# EasyEDA schematic SCH_Acid-Leak_2026-06-09.json
TITLE: ACID LEAK - Bass Distortion; REV: 1.0; Date: 2026-06-05; Sheet: 1/1; Drawn By: Jakub Krysakowski
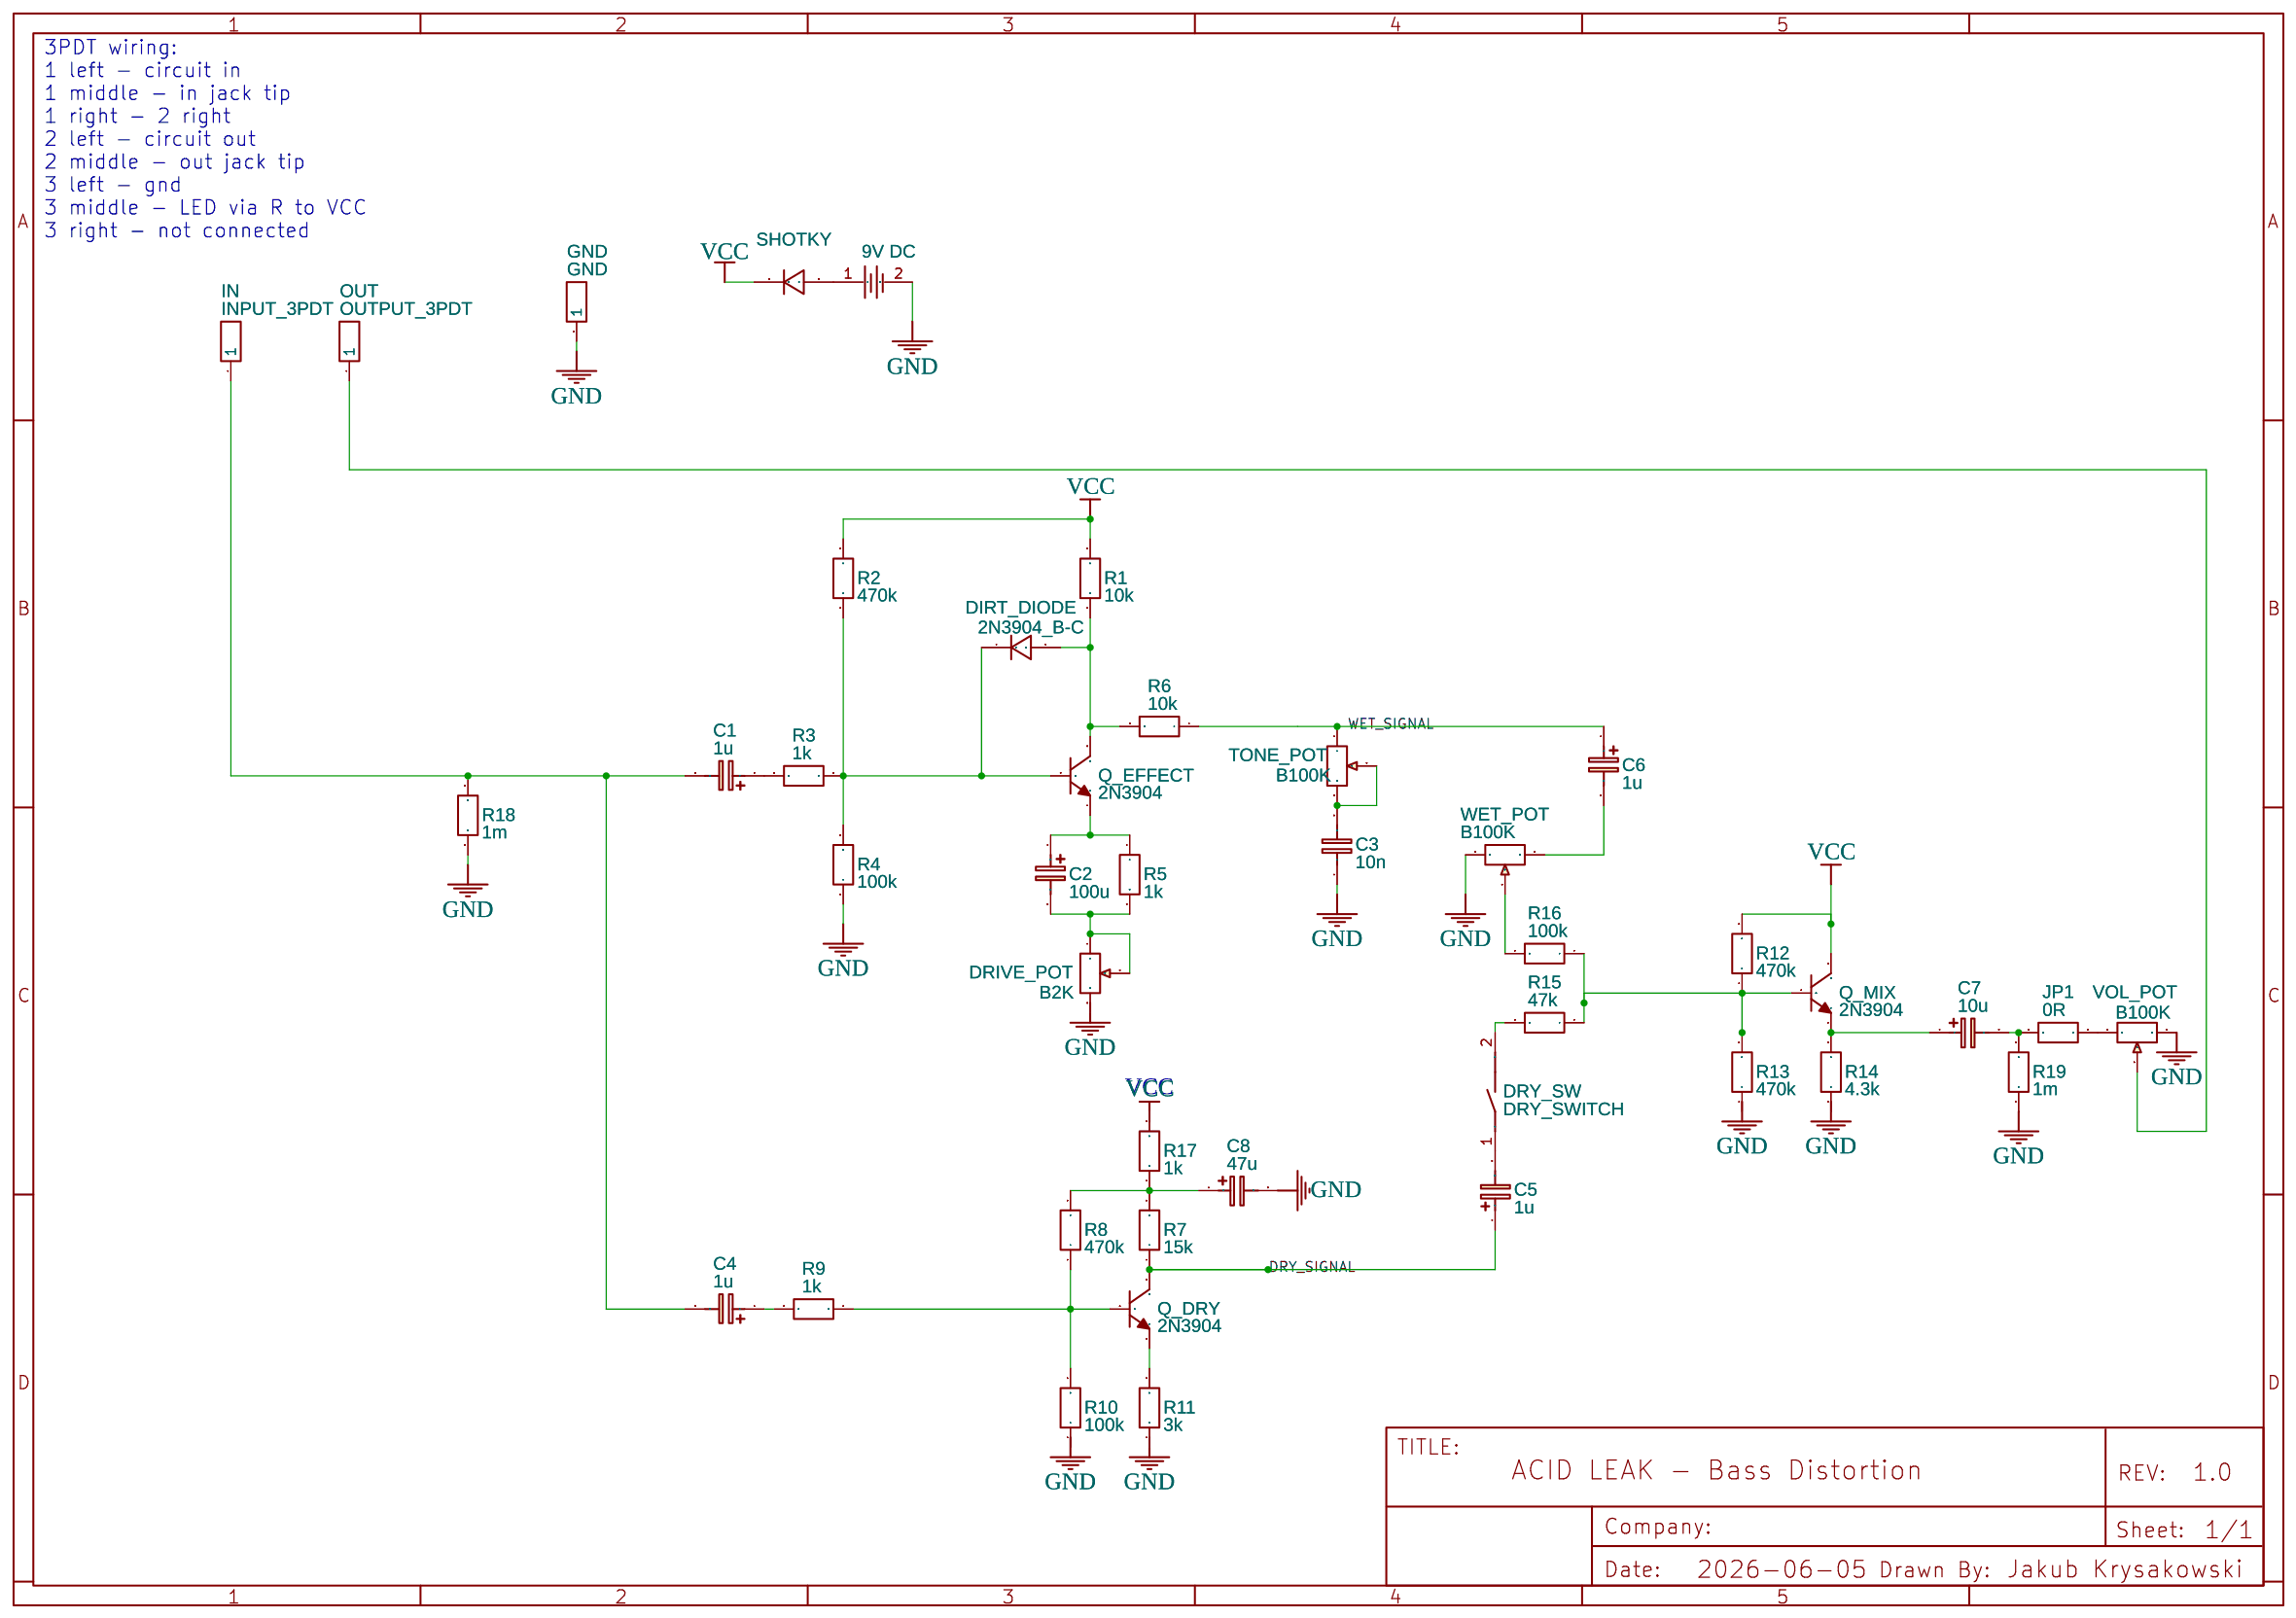
[diagram p0: schematic sheet]

## Parts
C1  1u  [CAP-5*12]
C2  100u  [CAP-5*12]
C3  10n  [CAP-5*9.5*3]
C4  1u  [CAP-5*12]
C5  1u  [CAP-5*12]
C6  1u  [CAP-5*12]
C7  10u  [CAP-5*12]
C8  47u  [CAP-5*12]
DIRT_DIODE  2N3904_B-C  [DIODE]
DRIVE_POT  B2K  [POTENTIOMETER]
DRY_SW  DRY_SWITCH  [SW]
GND  GND  [HDR-M-2.54_1X1]
IN  INPUT_3PDT  [HDR-M-2.54_1X1]
JP1  0R  [R_AXIAL-0.3]
OUT  OUTPUT_3PDT  [HDR-M-2.54_1X1]
PWR  9V DC  [9V]
Q_DRY  2N3904  [TO-92-3_L4.6-W3.6-P1.30-L_2N3904]
Q_EFFECT  2N3904  [TO-92-3_L4.6-W3.6-P1.30-L_2N3904]
Q_MIX  2N3904  [TO-92-3_L4.6-W3.6-P1.30-L_2N3904]
R1  10k  [R_AXIAL-0.3]
R2  470k  [R_AXIAL-0.3]
R3  1k  [R_AXIAL-0.3]
R4  100k  [R_AXIAL-0.3]
R5  1k  [R_AXIAL-0.3]
R6  10k  [R_AXIAL-0.3]
R7  15k  [R_AXIAL-0.3]
R8  470k  [R_AXIAL-0.3]
R9  1k  [R_AXIAL-0.3]
R10  100k  [R_AXIAL-0.3]
R11  3k  [R_AXIAL-0.3]
R12  470k  [R_AXIAL-0.3]
R13  470k  [R_AXIAL-0.3]
R14  4.3k  [R_AXIAL-0.3]
R15  47k  [R_AXIAL-0.3]
R16  100k  [R_AXIAL-0.3]
R17  1k  [R_AXIAL-0.3]
R18  1m  [R_AXIAL-0.3]
R19  1m  [R_AXIAL-0.3]
SHOTKY  Shotky  [DO-35_BD2.0-L4.2-P8.20-D0.5-RD]
TONE_POT  B100K  [POTENTIOMETER]
VOL_POT  B100K  [POTENTIOMETER]
WET_POT  B100K  [POTENTIOMETER]

## Library data of the parts
C1 C2 C4-C8 = CE_TH_D8.0×F3.5_EU: Contributor: LCEDA_Lib
C3 = C_RAD-0.1_EU: Contributor: LCEDA_Lib
DIRT_DIODE = 1N4148: Supplier: LCSC; Supplier Part: C13769; Manufacturer: STMicroelectronics; Contributor: LCSC; Package Display: No
DRIVE_POT TONE_POT VOL_POT WET_POT = R_3296W_EU: Supplier: LCSC; Contributor: LCEDA_Lib; Value(Ω): 10k
DRY_SW = DS-1-B-T: Supplier: LCSC; Supplier Part: C7503464; Manufacturer: XUNPU(讯普); Contributor: lcsc; JLCPCB Part Class: Extended Part
GND IN OUT = HDR-M-2.54_1x1: Supplier Part: C81276; Supplier: LCSC; Contributor: LCEDA_Lib
JP1 R1-R6 R8-R19 = R_0603_EU: Contributor: LCEDA_Lib
PWR = CR2032-BS-2-1: Supplier: LCSC; Manufacturer: Q&J; Manufacturer Part: BS-2-1; image: //image.lceda.cn/szlcsc/C70376.jpg; Supplier Part: C70376; Package Display: No
Q_DRY Q_EFFECT Q_MIX = 2N3904(SOT-23): Supplier: LCSC; Manufacturer: KEC; Manufacturer Part: 2n3904S-RTK/PS; Supplier Part: C18536; Paste Type: SOT-23; Contributor: LCEDA_Lib
R7 = R_0603_EU: Contributor: LCEDA_Lib; Package Display: No
SHOTKY = 1N4148: Supplier: LCSC; Supplier Part: C13769; Manufacturer: STMicroelectronics; Contributor: LCSC

## Nets
GND: C3.1 C8.2 DRIVE_POT.3 GND.1 PWR.2 R4.1 R10.1 R11.1 R13.1 R14.1 R18.1 R19.1 VOL_POT.1 WET_POT.3
VCC: Q_MIX.3(C) R1.2 R2.2 R12.2 R17.2 SHOTKY.1
DRY_SIGNAL: C5.1 Q_DRY.3(C) R7.1
WET_SIGNAL: C6.1 R6.1 TONE_POT.1
Net-(C1-1): C1.1 R3.2
Net-(C1-2): C1.2 C4.2 IN.1 R18.2
Net-(C2-1): C2.1 Q_EFFECT.1(E) R5.1
Net-(C2-2): C2.2 DRIVE_POT.1 DRIVE_POT.2 R5.2
Net-(C3-2): C3.2 TONE_POT.2 TONE_POT.3
Net-(C4-1): C4.1 R9.2
Net-(C5-2): C5.2 DRY_SW.1
Net-(C6-2): C6.2 WET_POT.1
Net-(C7-1): C7.1 Q_MIX.1(E) R14.2
Net-(C7-2): C7.2 JP1.2 R19.2
Net-(C8-1): C8.1 R7.2 R8.2 R17.1
Net-(DIRT_DIODE-1): DIRT_DIODE.1 Q_EFFECT.2(B) R2.1 R3.1 R4.2
Net-(DIRT_DIODE-2): DIRT_DIODE.2 Q_EFFECT.3(C) R1.1 R6.2
Net-(DRY_SW-2): DRY_SW.2 R15.2
Net-(JP1-1): JP1.1 VOL_POT.3
Net-(OUT-1): OUT.1 VOL_POT.2
Net-(PWR-1): PWR.1 SHOTKY.2
Net-(Q_DRY-1): Q_DRY.1(E) R11.2
Net-(Q_DRY-2): Q_DRY.2(B) R8.1 R9.1 R10.2
Net-(Q_MIX-2): Q_MIX.2(B) R12.1 R13.2 R15.1 R16.1
Net-(R16-2): R16.2 WET_POT.2

## Notes on the sheet
- 3PDT wiring:
  1 left - circuit in
  1 middle - in jack tip
  1 right - 2 right
  2 left - circuit out
  2 middle - out jack tip
  3 left - gnd
  3 middle - LED via R to VCC
  3 right - not connected
- VCC
